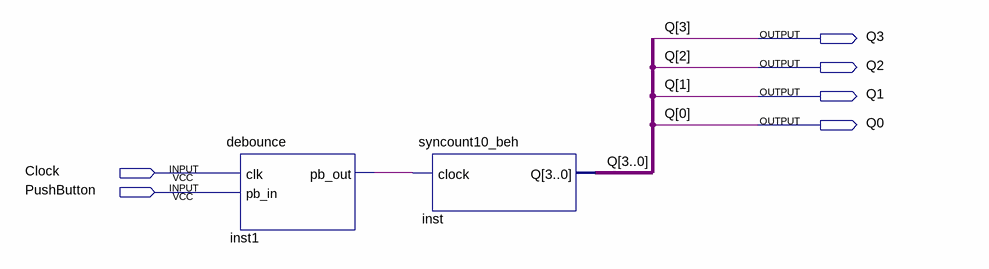
[diagram p0: schematic sheet]
// Quartus schematic syncount_test02.bdf as structural Verilog: 2 symbols, 6 pins
module syncount_test02 (
  input  Clock,
  input  PushButton,
  output Q3,
  output Q2,
  output Q1,
  output Q0
);

  wire inst1_pb_out;

  debounce inst1 (.clk(Clock), .pb_in(PushButton), .pb_out(inst1_pb_out));
  syncount10_beh inst (.clock(inst1_pb_out), .Q({Q3, Q2, Q1, Q0}));
endmodule
